# EAGLE design R1_Power (EAGLE 9.6.2)
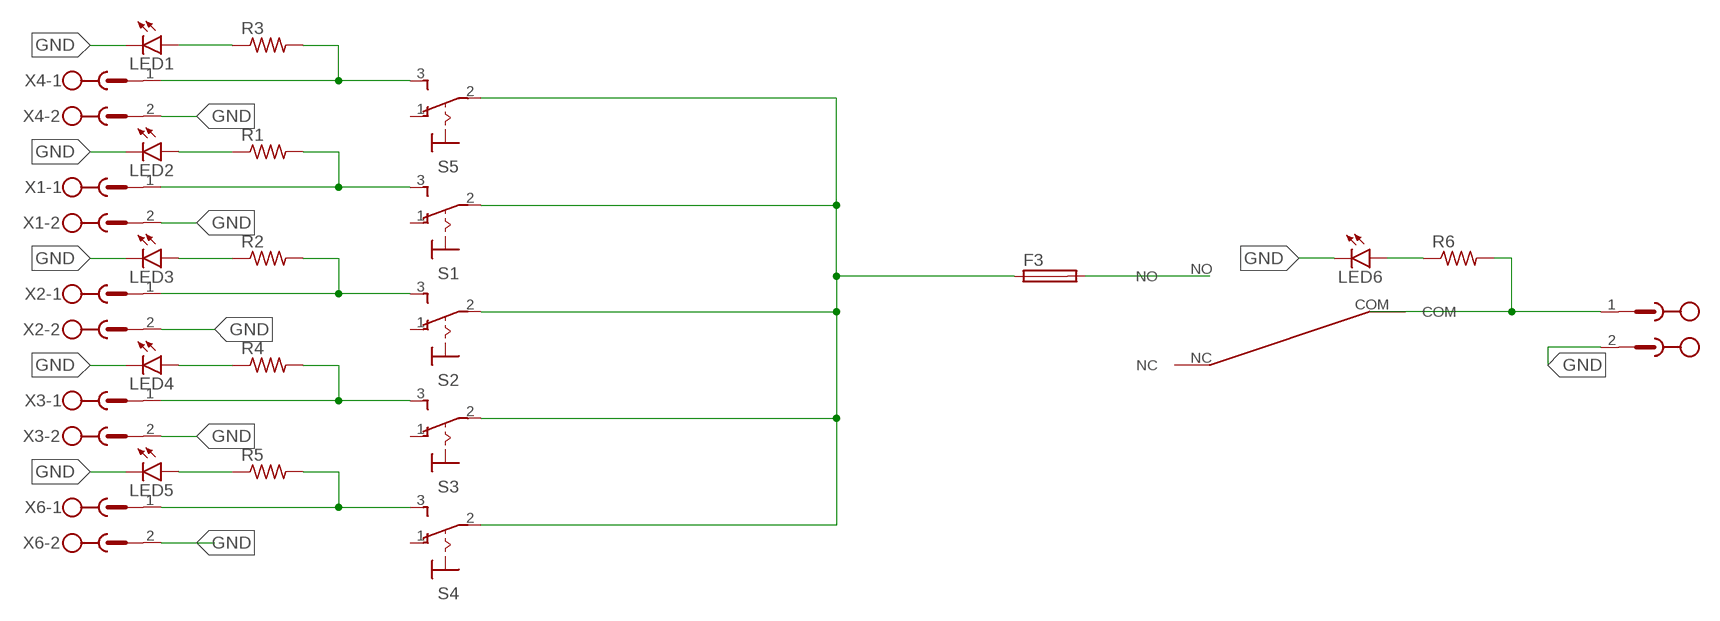
[diagram p0: schematic, sheet 1]

## Parts
F3  SH22,5  [SH22,5]
LED1  LED3MM  [LED3MM]
LED2  LED3MM  [LED3MM]
LED3  LED3MM  [LED3MM]
LED4  LED3MM  [LED3MM]
LED5  LED3MM  [LED3MM]
LED6  LED3MM  [LED3MM]
MAINSWITCH  SPDT_TOGGLE_1SPDT_TOGGLE_2  [SPDT_TOGGLE_1]
R1  R-US_0207/10  [0207/10]
R2  R-US_0207/10  [0207/10]
R3  R-US_0207/10  [0207/10]
R4  R-US_0207/10  [0207/10]
R5  R-US_0207/10  [0207/10]
R6  R-US_0207/10  [0207/10]
S1  320-916  [320-916]
S2  320-916  [320-916]
S3  320-916  [320-916]
S4  320-916  [320-916]
S5  320-916  [320-916]
VCC  MSTBV2  [MSTBV2]
X1  MSTBV2  [MSTBV2]
X2  MSTBV2  [MSTBV2]
X3  MSTBV2  [MSTBV2]
X4  MSTBV2  [MSTBV2]
X6  MSTBV2  [MSTBV2]

## Nets
GND: LED1.K(C) LED2.K(C) LED3.K(C) LED4.K(C) LED5.K(C) LED6.K(C) VCC.2 X1.2 X2.2 X3.2 X4.2 X6.2
N$1: F3.2 MAINSWITCH.NO
N$2: F3.1 S1.2(P) S2.2(P) S3.2(P) S4.2(P) S5.2(P)
N$3: R3.2 S5.3(S) X4.1
N$4: LED1.A R3.1
N$6: R1.2 S1.3(S) X1.1
N$8: LED3.A R2.1
N$9: R2.2 S2.3(S) X2.1
N$12: LED6.A R6.1
N$13: MAINSWITCH.COM R6.2 VCC.1
N$14: LED4.A R4.1
N$15: R4.2 S3.3(S) X3.1
N$16: LED2.A R1.1
N$17: R5.2 S4.3(S) X6.1
N$18: LED5.A R5.1
Unconnected: MAINSWITCH.NC S1.1(O) S2.1(O) S3.1(O) S4.1(O) S5.1(O)

## Library data of the parts
F3 = fuse:SH22,5: FUSE HOLDER grid 22,5 mm, OGN0031 8201, Schurter (Buerklin); MF: SCHURTER; MPN: 0031.8201; OC_FARNELL: 1162740; OC_NEWARK: 96F8317
LED1-LED6 = led:LED: LED OSRAM: - CHIPLED LG R971, LG N971, LY N971, LG Q971, LY Q971, LO R971, LY R971 LH N974, LH R974 LS Q976, LO Q976, LY Q976 LO Q996 - Hyper CHIPLED LW Q18S LB Q993, LB Q99A, LB R99A - SideLED LS A670, LO A670, LY A670, LG A670, LP A670 LB A673, LV A673, LT A673, LW A673 LH A674 LY A675 LS A676, LA A676, LO A676, LY A676, LW A676 LS A679, LY A679, LG A679 - Hyper Micro SIDELED® LS Y876, LA Y876, LO Y876, LY Y876 LT Y87S - SmartLED LW L88C, LW L88S LB L89C, LB L89S, LG L890 LS L89K, LO L89K, LY L89K LS L896, LA L896, LO L896, LY L896 - TOPLED LS T670, LO T670, LY T670, LG T670, LP T670 LSG T670, LSP T670, LSY T670, LOP T670, LYG T670 LG T671, LOG T671, LSG T671 LB T673, LV T673, LT T673, LW T673 LH T674 LS T676, LA T676, LO T676, LY T676, LB T676, LH T676, LSB T676, LW T676 LB T67C, LV T67C, LT T67C, LS T67K, LO T67K, LY T67K, LW E67C LS E67B, LA E67B, LO E67B, LY E67B, LB E67C, LV E67C, LT E67C LW T67C LS T679, LY T679, LG T679 LS T770, LO T770, LY T770, LG T770, LP T770 LB T773, LV T773, LT T773, LW T773 LH T774 LS E675, LA E675, LY E675, LS T675 LS T776, LA T776, LO T776, LY T776, LB T776 LHGB T686 LT T68C, LB T68C - Hyper Mini TOPLED® LB M676 - Mini TOPLED Santana® LG M470 LS M47K, LO M47K, LY M47K Source: http://www.osram.convergy.de LUXEON: - LUMILED® LXK2-PW12-R00, LXK2-PW12-S00, LXK2-PW14-U00, LXK2-PW14-V00 LXK2-PM12-R00, LXK2-PM12-S00, LXK2-PM14-U00 LXK2-PE12-Q00, LXK2-PE12-R00, LXK2-PE12-S00, LXK2-PE14-T00, LXK2-PE14-U00 LXK2-PB12-K00, LXK2-PB12-L00, LXK2-PB12-M00, LXK2-PB14-N00, LXK2-PB14-P00, LXK2-PB14-Q00 LXK2-PR12-L00, LXK2-PR12-M00, LXK2-PR14-Q00, LXK2-PR14-R00 LXK2-PD12-Q00, LXK2-PD12-R00, LXK2-PD12-S00 LXK2-PH12-R00, LXK2-PH12-S00 LXK2-PL12-P00, LXK2-PL12-Q00, LXK2-PL12-R00 Source: www.luxeon.com KINGBRIGHT: KA-3528ASYC Source: www.kingbright.com
MAINSWITCH = SPDT_TOGGLE_!:SPDT_TOGGLE_1
R1-R6 = rcl:R-US_: RESISTOR, American symbol; SPICEPREFIX: R
S1-S5 = switch:320-916: TOGGLE SWITCH distributor RS Components
VCC X1-X4 X6 = con-phoenix-500:MSTBV2: PHOENIX; OC_FARNELL: unknown; OC_NEWARK: unknown

## Board
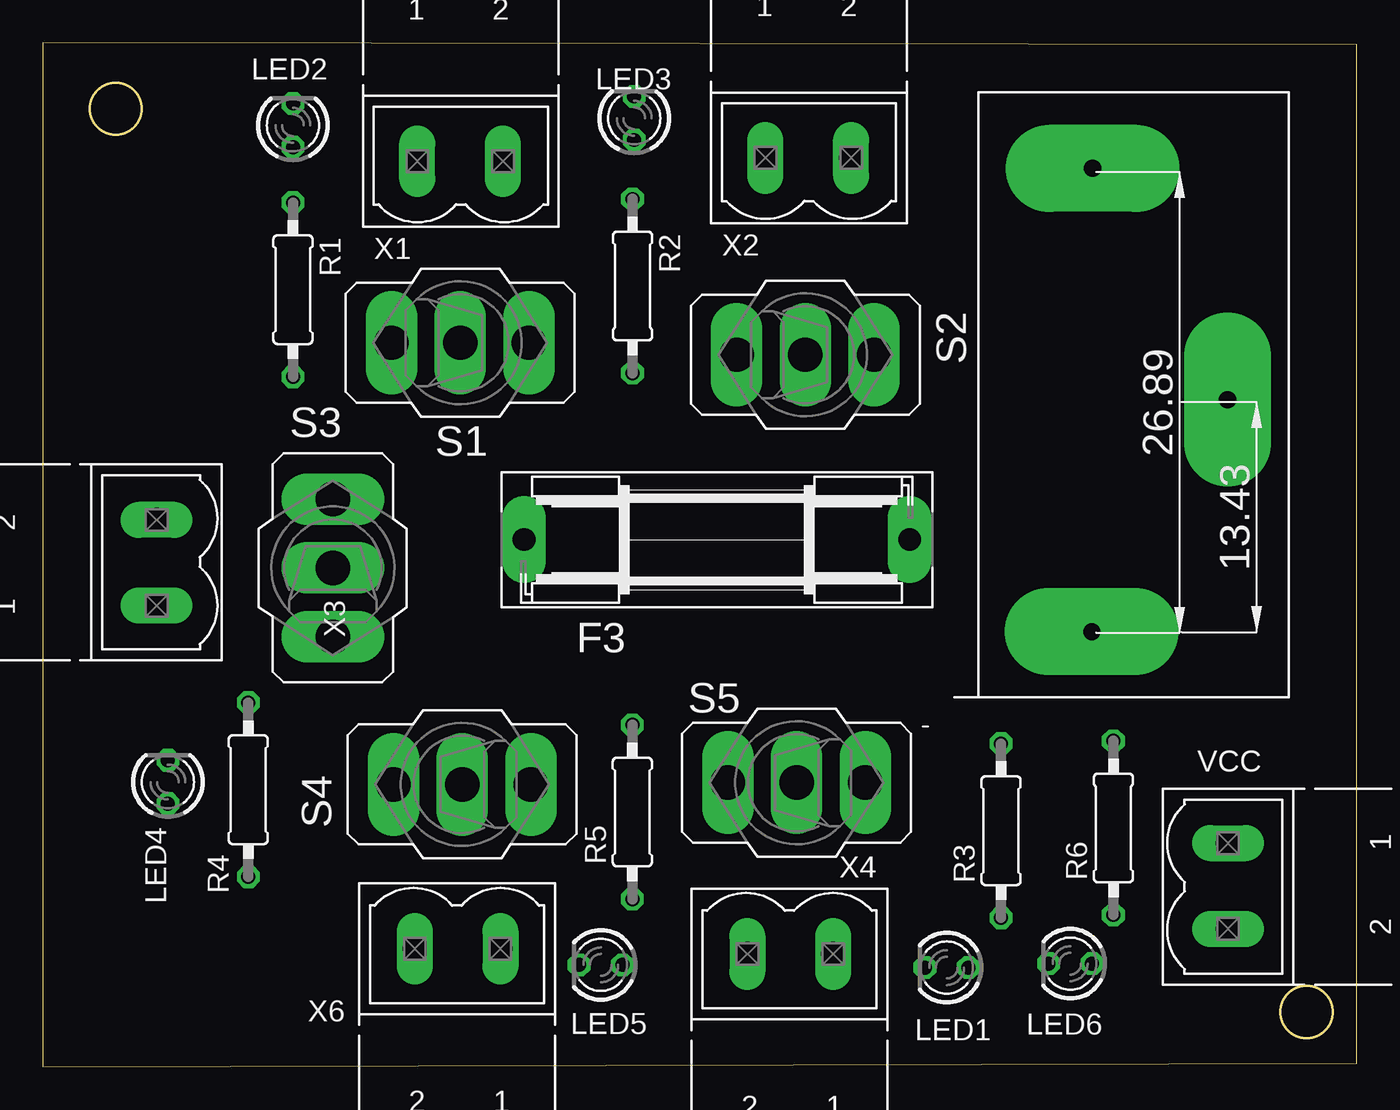
[diagram p1: board, top side]
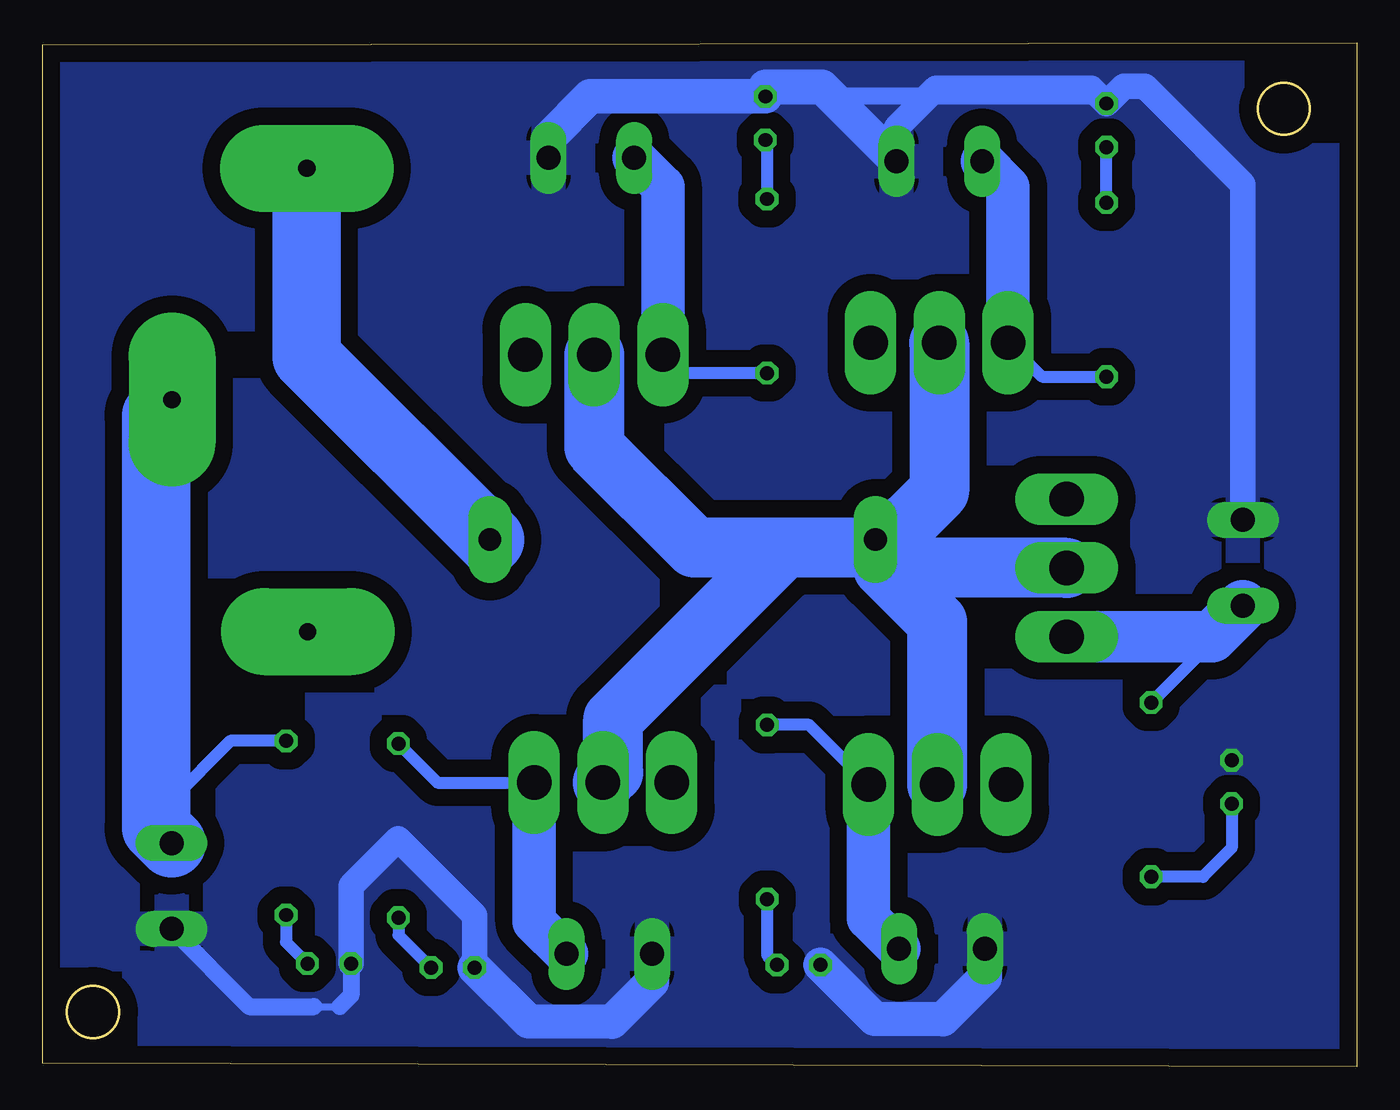
[diagram p2: board, bottom side, seen from below]

Size 76.69 x 59.74 mm. Coordinates in mm from the lower left corner, seen from the top.
Outline: 0,0 76.69,0.2 76.69,59.64 0,59.74 0,0
Outline: circle at 4.26,55.9 radius 1.5
Outline: circle at 73.76,3.2 radius 1.51
Copper layers (1*16): Top 0.035mm / dielectric 1.5mm / Bottom 0.035mm
Design rules "default": minimum track width 6mil, minimum drill 0.35mm, track to track 6mil, track to pad 6mil, pad to pad 6mil, via to via 6mil, smd to smd 6mil, copper to edge 40mil, drill to drill 6mil, minimum pad ring 10mil, minimum via ring 8mil, stop-mask expansion 4mil, vias tented up to drill 0mil, thermal gap 10mil

### Footprints (pad centres in the part's own frame; a part is rotated, then mirrored left to right if it is on the bottom)
SH22,5 = drill 1.321 pad 2.54 long: 1 -11.252,0; 2 11.252,0
LED3MM = drill 0.813 octagon: A -1.27,0; K 1.27,0
SPDT_TOGGLE_1 = drill 1 pad 5.08 long: COM -4.42,-9.07; NC -17.96,-1.15; NO 9.08,-1.2
0207/10 = drill 0.813 octagon: 1 -5.08,0; 2 5.08,0
320-916 = drill 2.007 long: 1 0,4.013; 2 0,0; 3 0,-4.013
MSTBV2 = drill 1.397 long: 1 -2.5,0; 2 2.5,0

### Placement (x,y rotation side)
F3  39.34,30.75 0 top
LED1  52.76,5.78 180 top
LED2  14.6,54.93 90 top
LED3  34.52,55.34 90 top
LED4  7.3,16.61 90 top
LED5  32.57,5.94 180 top
LED6  59.97,6.01 180 top
MAINSWITCH  60.08,43.34 90 top
R1  14.6,45.34 270 top
R2  34.42,45.55 270 top
R3  55.93,13.77 90 top
R4  11.99,16.16 90 top
R5  34.41,14.86 90 top
R6  62.49,13.93 90 top
S1  24.36,42.24 270 top
S2  44.51,41.54 270 top
S3  16.93,29.1 0 top
S4  24.48,16.47 90 top
S5  44,16.57 90 top
VCC  69.18,10.54 270 top
X1  24.36,52.83 0 top
X2  44.68,53.03 0 top
X3  6.64,29.4 90 top
X4  43.63,6.58 180 top
X6  24.21,6.88 180 top

### Tracks (layer width: path | path; a pad name or v marks a point on that pad's centre or on a via)
GND
  Bottom 0.406: 60.86,3.5 59.36,3.5
  Bottom 1: LED2.K 15.01,56.61 LED3.K | LED6.K 58.7,4.16 59.36,3.5 | VCC.2 64.64,3.5 60.86,3.5
  Bottom 1.5: X1.2 26.86,54.8 24.56,57.1 15.5,57.1 LED2.K 13.6,57.2 12.36,57.2 6.64,51.48 X3.2 | LED1.K 51.49,8.83 55.96,13.3 58.7,10.56 LED6.K
  Bottom 2: LED5.K 28.14,2.79 24.15,2.77 21.71,5.22 X6.2 | LED1.K 48.35,2.64 43.45,2.63 41.13,4.95 X4.2 | LED3.K 44.75,56.61 47.18,54.18 X2.2 | X1.2 31.21,57.18 34.52,57.18
  pour Bottom (isolate 1): 0.56,0 74.86,0 74.86,59.1 0.46,59.1
N$1
  Bottom 4: F3.2 61.28,41.44 MAINSWITCH.NO
N$2
  Bottom 3.5: S3.2 26.44,29.1 | 26.44,29.1 27.64,29.1 24.48,25.94 S4.2 | 27.64,30.3 F3.1 | S1.2 24.36,33.58 27.64,30.3 | S2.2 44.51,36.15 38.66,30.3 34.06,30.3 | 34.06,30.3 27.64,30.3 | S5.2 43.39,17.18 43.39,20.29 34.06,29.62 34.06,30.3 | 26.44,29.1 27.64,30.3
N$3
  Bottom 0.7: R3.2 53.65,16.57 S5.3
  Bottom 2.54: X4.1 48.01,8.46 S5.3 48.01,16.77
N$4
  Bottom 0.7: R3.1 55.93,7.68 LED1.A
N$6
  Bottom 0.7: S1.3 18.37,40.26 R1.2
  Bottom 2.54: X1.1 20.35,51.32 S1.3 20.35,42.26 20.55,42.46
N$8
  Bottom 0.7: LED3.A 34.42,53.97 R2.1
N$9
  Bottom 0.7: R2.2 39.43,40.47 S2.3
  Bottom 2.54: X2.1 40.5,51.35 S2.3
N$12
  Bottom 0.7: R6.1 62.49,7.26 LED6.A
N$13
  Bottom 0.7: R6.2 65.75,19.01 69.18,15.58 VCC.1
  Bottom 2.54: MAINSWITCH.COM 68.97,38.74
  Bottom 4: VCC.1 70.08,13.94 70.08,37.99 MAINSWITCH.COM
N$14
  Bottom 0.7: 12.02,11.05 R4.1 8.98,11.08 7.3,12.76 LED4.A
N$15
  Bottom 0.7: R4.2 6.64,26.59 X3.1
  Bottom 3: S3.3 8.45,25.09 X3.1
N$16
  Bottom 0.7: R1.1 LED2.A
N$17
  Bottom 0.7: S4.3 31.96,19.94 R5.2
  Bottom 2.54: S4.3 28.49,8.66 X6.1
N$18
  Bottom 0.7: R5.1 34.41,6.51 LED5.A